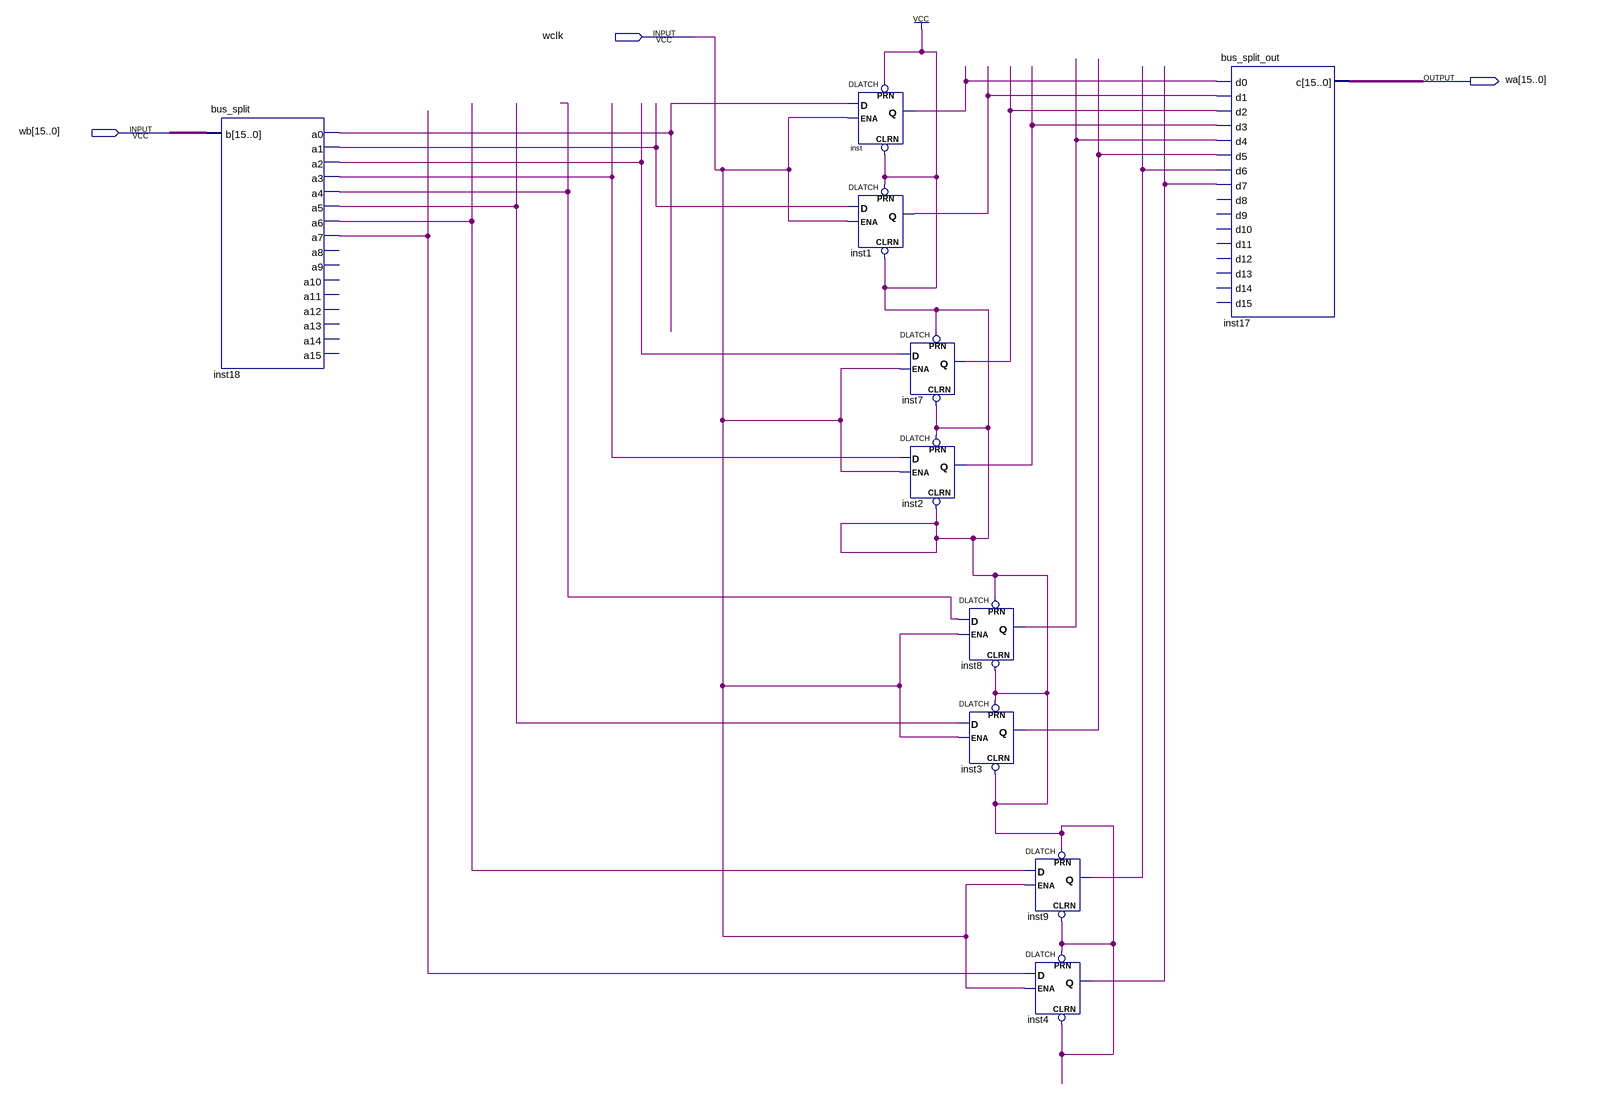
[diagram p0: schematic sheet]
// Quartus schematic 8bitdlatch.bdf as structural Verilog: 10 symbols, 3 pins
module \8bitdlatch  (
  input  wclk,
  input  [15:0] wb,
  output [15:0] wa
);

  wire inst1_q, inst2_q, inst3_q, inst4_q, inst7_q, inst8_q, inst9_q, inst18_a0, inst18_a1, inst18_a2,
       inst18_a3, inst18_a4, inst18_a5, inst18_a6, inst18_a7, inst_q;

  bus_split inst18 (
    .b(wb), .a0(inst18_a0), .a1(inst18_a1), .a2(inst18_a2), .a3(inst18_a3), .a4(inst18_a4), .a5(inst18_a5),
    .a6(inst18_a6), .a7(inst18_a7));  // open: a8, a9, a10, a11, a12, a13, a14, a15
  DLATCH inst (.CLRN(1'b1), .D(inst18_a0), .ENA(wclk), .PRN(1'b1), .Q(inst_q));
  DLATCH inst1 (.CLRN(1'b1), .D(inst18_a1), .ENA(wclk), .PRN(1'b1), .Q(inst1_q));
  DLATCH inst7 (.CLRN(1'b1), .D(inst18_a2), .ENA(wclk), .PRN(1'b1), .Q(inst7_q));
  DLATCH inst2 (.CLRN(1'b1), .D(inst18_a3), .ENA(wclk), .PRN(1'b1), .Q(inst2_q));
  DLATCH inst8 (.CLRN(1'b1), .D(inst18_a4), .ENA(wclk), .PRN(1'b1), .Q(inst8_q));
  DLATCH inst3 (.CLRN(1'b1), .D(inst18_a5), .ENA(wclk), .PRN(1'b1), .Q(inst3_q));
  DLATCH inst9 (.CLRN(1'b1), .D(inst18_a6), .ENA(wclk), .PRN(1'b1), .Q(inst9_q));
  DLATCH inst4 (.CLRN(1'b1), .D(inst18_a7), .ENA(wclk), .PRN(1'b1), .Q(inst4_q));
  bus_split_out inst17 (
    .d0(inst_q), .d1(inst1_q), .d2(inst7_q), .d3(inst2_q), .d4(inst8_q), .d5(inst3_q), .d6(inst9_q),
    .d7(inst4_q), .c(wa));  // open: d8, d9, d10, d11, d12, d13, d14, d15
endmodule
